# Altium schematic sheet SH2 - DIFFERENTIAL I2C.SchDoc
size Letter
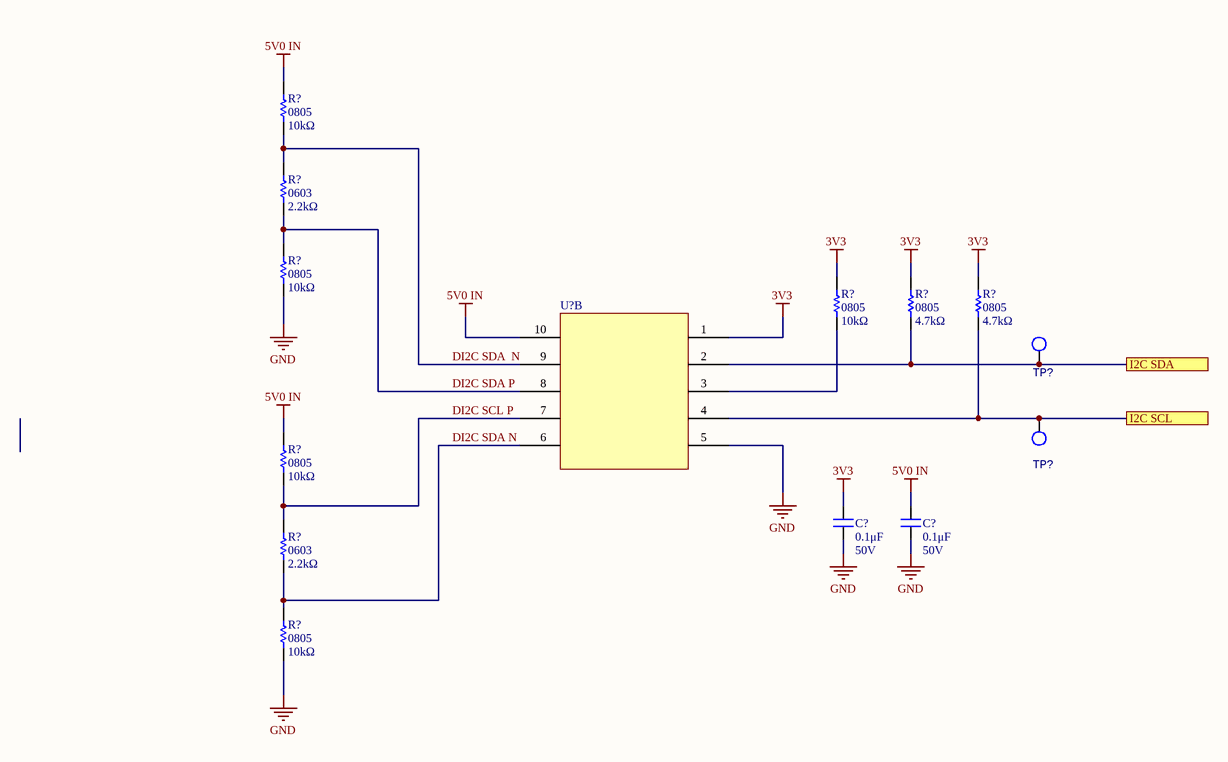
[diagram p0: SH2 - DIFFERENTIAL I2C.SchDoc]

## Parts
(Parts that share a designator on the sheet are numbered #1, #2 ... from top to bottom, then left to right.)
C?#1  0.1μF  Voltage Rating: 50V  [CAPC2012X140N]
C?#2  0.1μF  Voltage Rating: 50V  [CAPC2012X140N]
R?#1  value 10kΩ  Case Code (Imperial): 0805  [RESC2012X60N]  (hidden comment: RES_10kΩ_0805)
R?#2  value 2.2kΩ  Case Code (Imperial): 0603  [RESC0603(1608)_N]  (hidden comment: RES_2.2kΩ_0603)
R?#3  value 10kΩ  Case Code (Imperial): 0805  [RESC2012X60N]  (hidden comment: RES_10kΩ_0805)
R?#4  value 10kΩ  Case Code (Imperial): 0805  [RESC2012X60N]  (hidden comment: RES_10kΩ_0805)
R?#5  value 4.7kΩ  Case Code (Imperial): 0805  [RESC2012X60N]  (hidden comment: RES_4.7kΩ_0805)
R?#6  value 4.7kΩ  Case Code (Imperial): 0805  [RESC2012X60N]  (hidden comment: RES_4.7kΩ_0805)
R?#7  value 10kΩ  Case Code (Imperial): 0805  [RESC2012X60N]  (hidden comment: RES_10kΩ_0805)
R?#8  value 2.2kΩ  Case Code (Imperial): 0603  [RESC0603(1608)_N]  (hidden comment: RES_2.2kΩ_0603)
R?#9  value 10kΩ  Case Code (Imperial): 0805  [RESC2012X60N]  (hidden comment: RES_10kΩ_0805)
TP?#1  TESTPOINT_LOOP  [TESTPOINT_LOOP]  (value not drawn)
TP?#2  TESTPOINT_LOOP  [TESTPOINT_LOOP]  (value not drawn)
U?  PCA9615DPJ  [PCA9615DPJ]  (value not drawn)  (part B of 2)

## Ports
I2C SCL, I2C SDA

## Nets
3V3: C?#1.2 R?#4.2 R?#5.2 R?#6.2 U?.1(VDDA)
5V0 IN: C?#2.2 R?#1.2 R?#7.2 U?.10(VDDB)
GND: C?#1.1 C?#2.1 R?#3.1 R?#9.1 U?.5(VSS)
DI2C SCL P: R?#7.1 R?#8.2 U?.7(DSCLP)
DI2C SDA  N: R?#1.1 R?#2.2 U?.9(DSDAM)
DI2C SDA N: R?#8.1 R?#9.2 U?.6(DSCLM)
DI2C SDA P: R?#2.1 R?#3.2 U?.8(DSDAP)
I2C SCL: R?#6.1 TP?#2.1 U?.4(SCL) ; port I2C SCL
I2C SDA: R?#5.1 TP?#1.1 U?.2(SDA) ; port I2C SDA
NetR?#4_1: R?#4.1 U?.3(EN)

## Notes on the sheet
- Title
- Size:
- Date:
- Letter
- Drawn By:
- Sheet
- of
- File:

## Library data of the parts
C?#1 C?#2 = CAP_0.1uF_50V_0805: CAP CER 0.1UF 50V X7R 0805; Manufacturer 1: Murata Electronics; Manufacturer Part Number 1: GCD21BR71H104KA01L; Tolerance: 10%; Mount: Surface Mount; Case Code (Metric): 2012; Case Code (Imperial): 0805; Min Operating Temperature: -55°C; Max Operating Temperature: 125°C; Dielectric: X7R; Termination: SMD/SMT; Length: 2mm; Height: 1.25mm; Width: 0.049inch; Thickness: 0.049inch; Depth: 1.25mm; Ratings: AEC-Q200; Supplier 1: Digi-Key; Supplier Part Number 1: 490-11955-1-ND; Package: 0805 (2012 Metric); Value: 0.1μF
R?#1 R?#3 R?#4 R?#7 R?#9 = RES_10kΩ_0805: RES SMD 10K OHM 1% 1/8W 0805; Manufacturer 1: Yageo; Manufacturer Part Number 1: RC0805FR-0710KL; Power Rating: 125mW; Supplier 1: Digi-Key; Case Code (Metric): 2012; Min Operating Temperature: -55°C; Max Operating Temperature: 155°C; Resistance: 10K; Tolerance: 1%; Termination: SMD/SMT; Supplier Part Number 1: 311-10.0KCRCT-ND; Package: 0805 (2012 Metric)
R?#2 R?#8 = RES_2.2kΩ_0603: RES SMD 2.2K OHM 1% 1/10W 0603; Manufacturer 1: Yageo; Manufacturer Part Number 1: RC0603FR-072K2L; Dimensions: 0.063" L x 0.031" W (1.60mm x 0.80mm); Package: 0603 (1608 Metric); Supplier Part Number 1: 311-2.20KHRCT-ND; Supplier 1: Digi-Key; Mount: Surface Mount; Case Code (Metric): 1608; Tolerance: 1%
R?#5 R?#6 = RES_4.7kΩ_0805: RES SMD 4.7K OHM 5% 1/8W 0805; Manufacturer 1: Yageo; Manufacturer Part Number 1: RC0805JR-074K7L; Resistance: 4.7kR; Temperature Coefficient: 100ppm/°C; Power Rating: 125mW; Voltage Rating: 150V; Supplier 1: Digi-Key; Contact Plating: Tin,Lead,Matte; Case Code (Metric): 2012; Min Operating Temperature: -55°C; Max Operating Temperature: 155°C; Tolerance: 5%; Composition: Thick Film; Termination: SMD/SMT; Military Standard: Not; Length: 2mm; Depth: 1.25mm; REACH SVHC: Unknown; Supplier Part Number 1: 311-4.7KARCT-ND; Mount: Surface Mount; Package: 0805 (2012 Metric)
TP?#1 TP?#2 = TESTPOINT_LOOP: PC TEST POINT MINIATURE WHITE; Manufacturer 1: Keystone Electronics; Manufacturer Part Number 1: 5002; Supplier Part Number 1: 36-5002-ND; Supplier 1: Digi-Key; Mount: Through Hole
U? = DIFF_I2C_BUFFER: IC DIFF I2C BUFFER 2CH 10TSSOP; Manufacturer 1: NXP Semiconductors; Number of Channels: 2; Operating Supply Current: 16uA; Input: 2-Wire Bus; Max Frequency: 1MHz; Supplier 1: Digi-Key; Case/Package: 10-TSSOP; Number of Pins: 10; Min Operating Temperature: -40°C; Max Operating Temperature: 85°C; Supplier Part Number 1: 568-11484-1-ND; Mount: Surface Mount